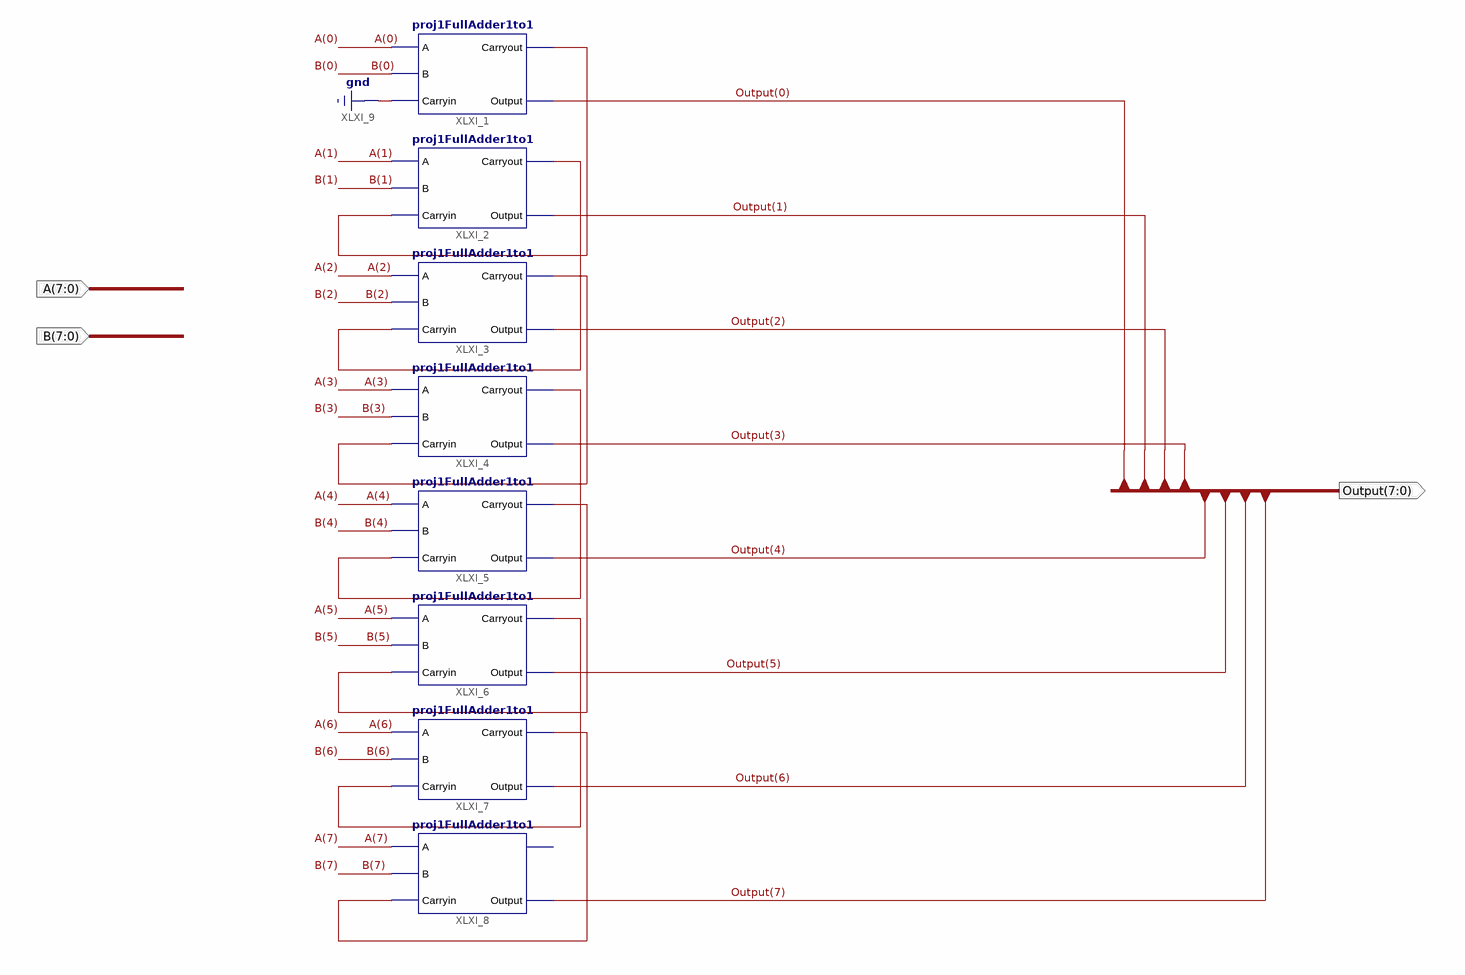
[diagram p0: schematic sheet 1]
// Xilinx ISE schematic proj1Adder8to8.sch (spartan6) as structural Verilog: 8 symbols, 3 ports
module proj1Adder8to8 (
  input  [7:0] A,
  input  [7:0] B,
  output [7:0] Output
);

  wire XLXN_3, XLXN_12, XLXN_18, XLXN_23, XLXN_26, XLXN_29, XLXN_34;

  proj1FullAdder1to1 XLXI_1 (.A(A[0]), .B(B[0]), .Carryin(1'b0), .Carryout(XLXN_3), .Output(Output[0]));
  proj1FullAdder1to1 XLXI_2 (.A(A[1]), .B(B[1]), .Carryin(XLXN_3), .Carryout(XLXN_12), .Output(Output[1]));
  proj1FullAdder1to1 XLXI_3 (.A(A[2]), .B(B[2]), .Carryin(XLXN_12), .Carryout(XLXN_18), .Output(Output[2]));
  proj1FullAdder1to1 XLXI_4 (.A(A[3]), .B(B[3]), .Carryin(XLXN_18), .Carryout(XLXN_23), .Output(Output[3]));
  proj1FullAdder1to1 XLXI_5 (.A(A[4]), .B(B[4]), .Carryin(XLXN_23), .Carryout(XLXN_26), .Output(Output[4]));
  proj1FullAdder1to1 XLXI_6 (.A(A[5]), .B(B[5]), .Carryin(XLXN_26), .Carryout(XLXN_29), .Output(Output[5]));
  proj1FullAdder1to1 XLXI_7 (.A(A[6]), .B(B[6]), .Carryin(XLXN_29), .Carryout(XLXN_34), .Output(Output[6]));
  proj1FullAdder1to1 XLXI_8 (.A(A[7]), .B(B[7]), .Carryin(XLXN_34), .Output(Output[7]));  // open: Carryout
endmodule
